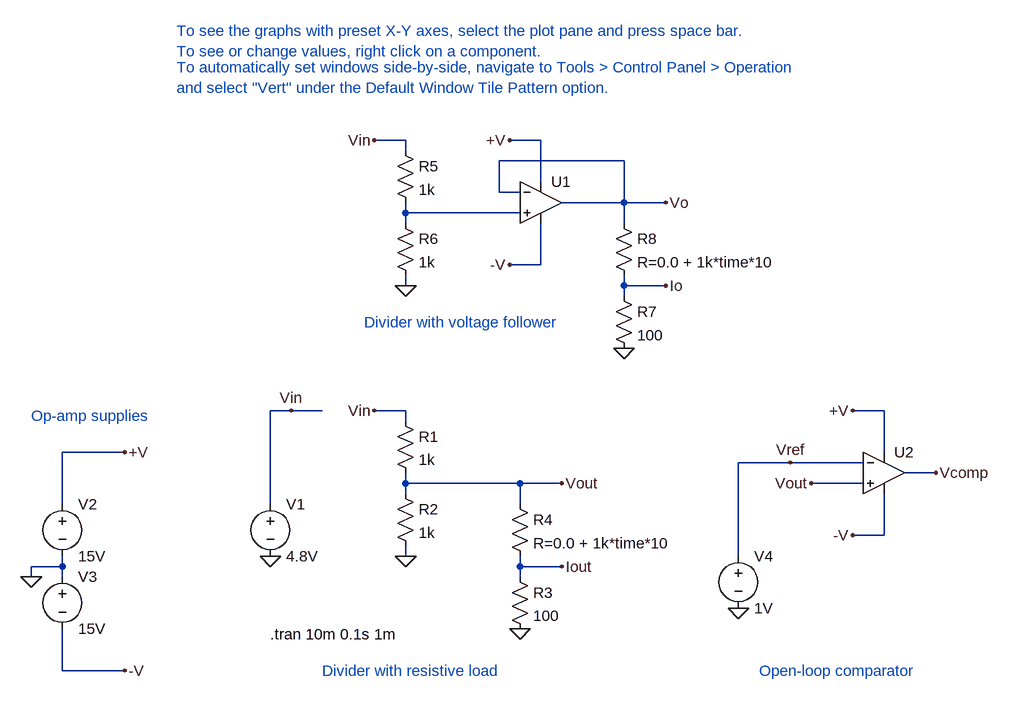
[diagram p0: schematic Divider.asc]
Divider.asc, the LTspice schematic file:
Version 4
SHEET 1 1600 680
WIRE 160 -352 112 -352
WIRE 368 -352 320 -352
WIRE 160 -336 160 -352
WIRE 496 -320 304 -320
WIRE 368 -288 368 -352
WIRE 304 -272 304 -320
WIRE 336 -272 304 -272
WIRE 496 -256 496 -320
WIRE 496 -256 400 -256
WIRE 560 -256 496 -256
WIRE 160 -240 160 -256
WIRE 336 -240 160 -240
WIRE 160 -224 160 -240
WIRE 496 -224 496 -256
WIRE 368 -160 368 -224
WIRE 368 -160 320 -160
WIRE 160 -128 160 -144
WIRE 496 -128 496 -144
WIRE 560 -128 496 -128
WIRE 496 -112 496 -128
WIRE -16 64 -48 64
WIRE 32 64 -16 64
WIRE 160 64 112 64
WIRE 896 64 848 64
WIRE 160 80 160 64
WIRE -272 128 -368 128
WIRE 896 128 896 64
WIRE 752 144 672 144
WIRE 864 144 752 144
WIRE 976 160 928 160
WIRE 160 176 160 160
WIRE 336 176 160 176
WIRE 400 176 336 176
WIRE 864 176 784 176
WIRE 160 192 160 176
WIRE -368 208 -368 128
WIRE -48 208 -48 64
WIRE 336 208 336 176
WIRE 896 256 896 192
WIRE 896 256 848 256
WIRE 160 288 160 272
WIRE 672 288 672 144
WIRE -368 304 -368 288
WIRE -368 304 -416 304
WIRE 336 304 336 288
WIRE 400 304 336 304
WIRE -416 320 -416 304
WIRE -368 320 -368 304
WIRE 336 320 336 304
WIRE -368 464 -368 400
WIRE -272 464 -368 464
FLAG 160 288 0
FLAG 112 64 Vin
FLAG 400 176 Vout
FLAG 336 400 0
FLAG 400 304 Iout
FLAG -16 64 Vin
FLAG -48 288 0
FLAG 160 -128 0
FLAG 112 -352 Vin
FLAG 560 -256 Vo
FLAG 496 -32 0
FLAG 560 -128 Io
FLAG -416 320 0
FLAG -272 128 +V
FLAG -272 464 -V
FLAG 320 -352 +V
FLAG 320 -160 -V
FLAG 848 64 +V
FLAG 848 256 -V
FLAG 976 160 Vcomp
FLAG 752 144 Vref
FLAG 784 176 Vout
FLAG 672 368 0
SYMBOL res 144 64 R0
SYMATTR InstName R1
SYMATTR Value 1k
SYMBOL res 144 176 R0
SYMATTR InstName R2
SYMATTR Value 1k
SYMBOL res 320 304 R0
SYMATTR InstName R3
SYMATTR Value 100
SYMBOL res 320 192 R0
SYMATTR InstName R4
SYMATTR Value R=0.0 + 1k*time*10
SYMBOL voltage -48 192 R0
SYMATTR InstName V1
SYMATTR Value 4.8V
SYMBOL res 144 -352 R0
SYMATTR InstName R5
SYMATTR Value 1k
SYMBOL res 144 -240 R0
SYMATTR InstName R6
SYMATTR Value 1k
SYMBOL res 480 -128 R0
SYMATTR InstName R7
SYMATTR Value 100
SYMBOL res 480 -240 R0
SYMATTR InstName R8
SYMATTR Value R=0.0 + 1k*time*10
SYMBOL OpAmps\\UniversalOpamp2 368 -256 R0
SYMATTR InstName U1
SYMATTR Value2 Avol=0.2Meg GBW=4Meg Slew=10Meg
SYMATTR SpiceLine Ilimit=60m Rail=1 Vos=0
SYMATTR SpiceLine2 En=0 Enk=0 In=0 Ink=0 Rin=1000G
SYMBOL voltage -368 192 R0
SYMATTR InstName V2
SYMATTR Value 15V
SYMBOL voltage -368 304 R0
SYMATTR InstName V3
SYMATTR Value 15V
SYMBOL OpAmps\\UniversalOpamp2 896 160 R0
SYMATTR InstName U2
SYMATTR Value2 Avol=0.2Meg GBW=4Meg Slew=10Meg
SYMATTR SpiceLine Ilimit=60m Rail=1 Vos=0
SYMBOL voltage 672 272 R0
SYMATTR InstName V4
SYMATTR Value 1V
TEXT -48 408 Left 2 !.tran 10m 0.1s 1m
TEXT -192 -520 Left 2 ;To see the graphs with preset X-Y axes, select the plot pane and press space bar.\nTo see or change values, right click on a component.
TEXT -416 72 Left 2 ;Op-amp supplies
TEXT 32 464 Left 2 ;Divider with resistive load
TEXT 96 -72 Left 2 ;Divider with voltage follower
TEXT 704 464 Left 2 ;Open-loop comparator
TEXT -192 -464 Left 2 ;To automatically set windows side-by-side, navigate to Tools > Control Panel > Operation \nand select "Vert" under the Default Window Tile Pattern option.

The netlist it stands for:
* Divider.asc
R1 Vin Vout 1k
R2 Vout 0 1k
R3 Iout 0 100
R4 Vout Iout R=0.0 + 1k*time*10
V1 Vin 0 4.8V
R5 Vin N001 1k
R6 N001 0 1k
R7 Io 0 100
R8 Vo Io R=0.0 + 1k*time*10
XU1 N001 Vo +V -V Vo level.2 Avol=0.2Meg GBW=4Meg Slew=10Meg Ilimit=60m Rail=1 Vos=0 En=0 Enk=0 In=0 Ink=0 Rin=1000G  ; pins IN+ IN- V+ V- OUT
V2 +V 0 15V
V3 0 -V 15V
XU2 Vout Vref +V -V Vcomp level.2 Avol=0.2Meg GBW=4Meg Slew=10Meg Ilimit=60m Rail=1 Vos=0 en=0 enk=0 in=0 ink=0 Rin=500Meg  ; pins IN+ IN- V+ V- OUT
V4 Vref 0 1V
.tran 10m 0.1s 1m
* To see the graphs with preset X-Y axes, select the plot pane and press space bar.
* To see or change values, right click on a component.
* Op-amp supplies
* Divider with resistive load
* Divider with voltage follower
* Open-loop comparator
* To automatically set windows side-by-side, navigate to Tools > Control Panel > Operation
* and select "Vert" under the Default Window Tile Pattern option.
.lib UniversalOpamps2.sub
.backanno
.end